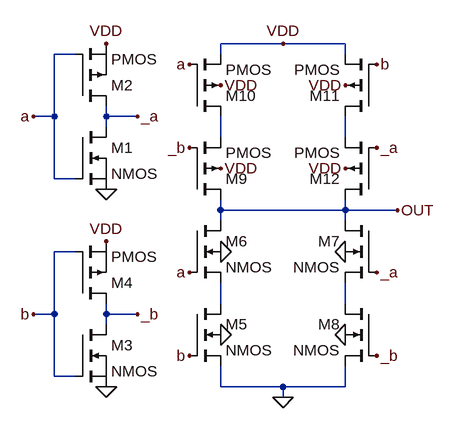
[diagram p0: schematic XOR.asc]
XOR.asc, the LTspice schematic file:
Version 4
SHEET 1 1288 1012
WIRE 592 368 496 368
WIRE 688 368 592 368
WIRE 272 384 240 384
WIRE 496 384 496 368
WIRE 688 384 688 368
WIRE 240 480 240 384
WIRE 240 480 208 480
WIRE 320 480 320 464
WIRE 368 480 320 480
WIRE 320 496 320 480
WIRE 496 512 496 480
WIRE 688 512 688 480
WIRE 240 576 240 480
WIRE 272 576 240 576
WIRE 496 624 496 608
WIRE 688 624 688 608
WIRE 688 624 496 624
WIRE 768 624 688 624
WIRE 496 640 496 624
WIRE 688 640 688 624
WIRE 272 688 240 688
WIRE 496 768 496 736
WIRE 688 768 688 736
WIRE 240 784 240 688
WIRE 240 784 208 784
WIRE 320 784 320 768
WIRE 368 784 320 784
WIRE 320 800 320 784
WIRE 240 880 240 784
WIRE 272 880 240 880
WIRE 496 896 496 864
WIRE 592 896 496 896
WIRE 688 896 688 864
WIRE 688 896 592 896
WIRE 592 912 592 896
FLAG 320 592 0
FLAG 320 896 0
FLAG 208 480 a
FLAG 208 784 b
FLAG 592 912 0
FLAG 320 368 VDD
FLAG 320 672 VDD
FLAG 448 400 a
FLAG 448 720 a
FLAG 736 400 b
FLAG 448 848 b
FLAG 736 528 _a
FLAG 736 720 _a
FLAG 448 528 _b
FLAG 736 848 _b
FLAG 368 784 _b
FLAG 368 480 _a
FLAG 592 368 VDD
FLAG 768 624 OUT
FLAG 496 816 0
FLAG 688 816 0
FLAG 496 688 0
FLAG 688 688 0
FLAG 496 560 VDD
FLAG 688 560 VDD
FLAG 688 432 VDD
FLAG 496 432 VDD
SYMBOL nmos 272 496 R0
SYMATTR InstName M1
SYMBOL pmos 272 464 M180
SYMATTR InstName M2
SYMBOL nmos 272 800 R0
SYMATTR InstName M3
SYMBOL pmos 272 768 M180
SYMATTR InstName M4
SYMBOL nmos4 448 768 R0
SYMATTR InstName M5
SYMBOL nmos4 448 640 R0
SYMATTR InstName M6
SYMBOL nmos4 736 640 M0
SYMATTR InstName M7
SYMBOL nmos4 736 768 M0
SYMATTR InstName M8
SYMBOL pmos4 448 608 M180
SYMATTR InstName M9
SYMBOL pmos4 448 480 M180
SYMATTR InstName M10
SYMBOL pmos4 736 480 R180
SYMATTR InstName M11
SYMBOL pmos4 736 608 R180
SYMATTR InstName M12

The netlist it stands for:
* XOR.asc
M1 _a a 0 0 NMOS
M2 _a a VDD VDD PMOS
M3 _b b 0 0 NMOS
M4 _b b VDD VDD PMOS
M5 N003 b 0 0 NMOS
M6 OUT a N003 0 NMOS
M7 OUT _a N004 0 NMOS
M8 N004 _b 0 0 NMOS
M9 OUT _b N001 VDD PMOS
M10 N001 a VDD VDD PMOS
M11 N002 b VDD VDD PMOS
M12 OUT _a N002 VDD PMOS
.model NMOS NMOS
.model PMOS PMOS
.lib standard.mos
.backanno
.end